# Altium schematic sheet PESD0603-240_C29296171_PESD0603-240_C2929617.schdoc
size 127 x 101 mm
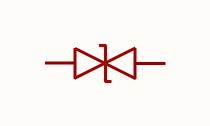
[diagram p0: PESD0603-240_C29296171_PESD0603-240_C2929617.schdoc]

## Parts
U?  PESD0603-240  [D0603-BI]  (value not drawn)

## Nets

Not connected (* = marked no-connect by the designer): U? 1 2

## Library data of the parts
U? = PESD0603-240_C2929617: Manufacturer: Littelfuse(美国力特); Add into BOM: yes; Maximum Clamping Voltage: 45V; Number of Lines: 单路; Symbol: PESD0603-240_C2929617; Device: PESD0603-240_C2929617; LCSC Part Name: PESD0603-240; Supplier Part: C2929617; Manufacturer Part: PESD0603-240; Supplier Footprint: 0603; JLCPCB Part Class: Extended Part; Datasheet: https://atta.szlcsc.com/upload/public/pdf/source/20180516/C207186_7CE2F9DCABF8CE4AA3105E54FFDB24F6.pdf; Supplier: LCSC; Convert to PCB: yes; Breakdown Voltage: -; Type: ESD